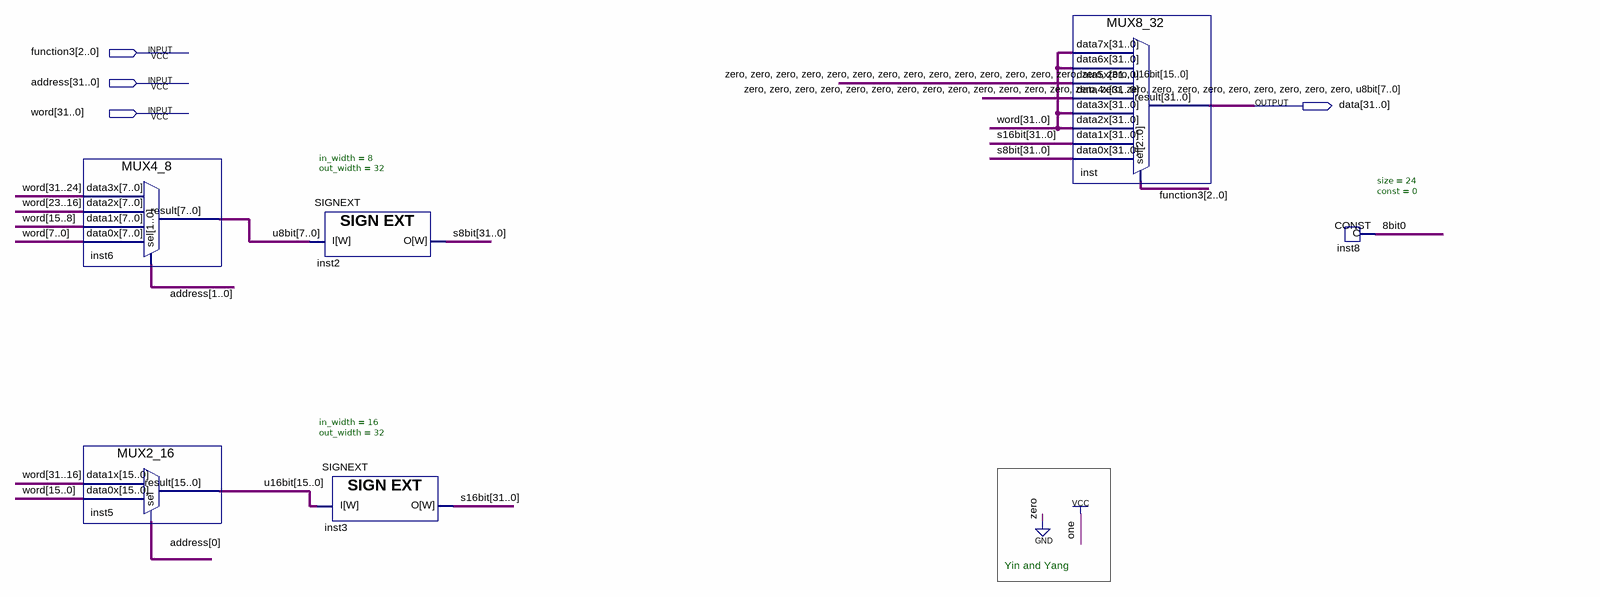
[diagram p0: schematic sheet]
// Quartus schematic MDRGenerator.bdf as structural Verilog: 6 symbols, 4 pins
module MDRGenerator (
  input  [2:0] function3,
  input  [31:0] address,
  input  [31:0] word,
  output [31:0] data
);

  wire \8bit0 ;
  wire [7:0] u8bit;
  wire [15:0] u16bit;
  wire [31:0] s8bit, s16bit;

  MUX4_8 inst6 (
    .data3x(word[31:24]), .data2x(word[23:16]), .data1x(word[15:8]), .data0x(word[7:0]), .sel(address[1:0]),
    .result(u8bit));
  MUX2_16 inst5 (.data1x(word[31:16]), .data0x(word[15:0]), .sel(address[0]), .result(u16bit));
  SIGNEXT #(.in_width(8), .out_width(32)) inst2 (.I(u8bit), .O(s8bit));
  SIGNEXT #(.in_width(16), .out_width(32)) inst3 (.I(u16bit), .O(s16bit));
  MUX8_32 inst (
    .data7x(word), .data6x(word), .data5x({{16{1'b0}}, u16bit}), .data4x({{24{1'b0}}, u8bit}), .data3x(word),
    .data2x(word), .data1x(s16bit), .data0x(s8bit), .sel(function3), .result(data));
  CONST #(.size(24), .\const (0)) inst8 (.data(\8bit0 ));

  // Notes on the sheet:
  //   Yin and Yang
endmodule
